# Altium schematic sheet POWER.SchDoc
size A4
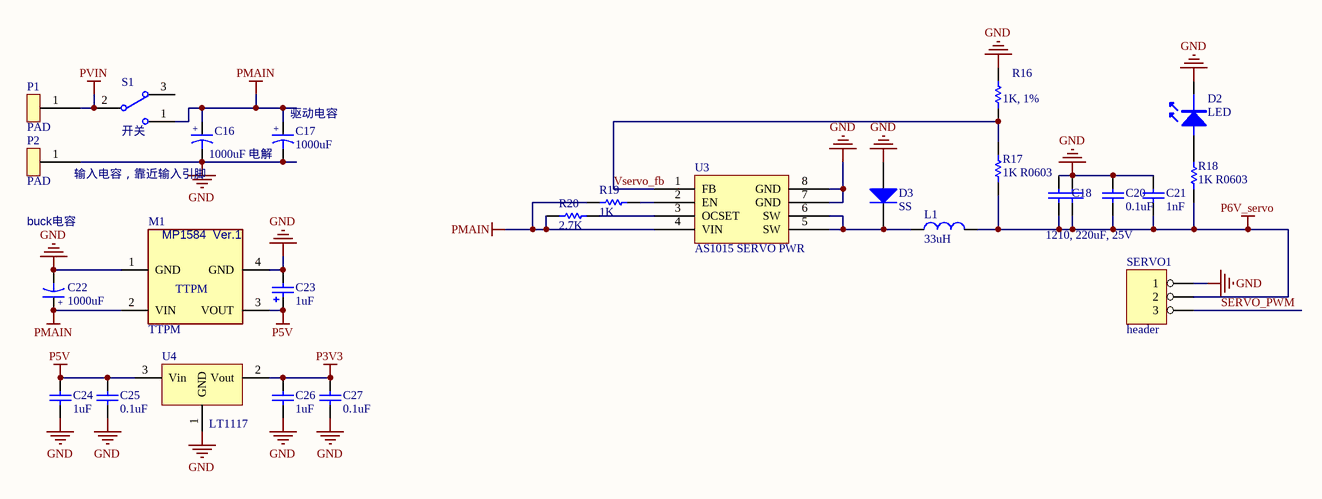
[diagram p0: POWER.SchDoc]

## Parts
C16  1000uF 电解  [CAP_1000x2000]
C17  1000uF  [CAP_1000x2000]
C18  1210, 220uF, 25V  [CAP_1000x2000]
C19  1210, 220uF, 25V  [C1210]  (value not drawn)
C20  0.1uF  [0603_C]
C21  1nF  [C1206]
C22  1000uF  [CAP_1000x2000]
C23  1uF  [CAPC6032C]
C24  1uF  [0805_c]
C25  0.1uF  [0603_C]
C26  1uF  [0805_c]
C27  0.1uF  [0603_C]
D2  LED  [0603_LED]
D3  SS  [DO-214AC(]
L1  33uH  [L 5x5]
M1  TTPM  [TTPM_1]
P1  PAD  [PAD_BIG]
P2  PAD  [PAD_BIG]
R16  1K, 1%  [0603_R]
R17  1K R0603  [0603_R]
R18  1K R0603  [0603_R]
R19  1K  [0603_R]
R20  2.7K  [0603_R]
S1  开关  [拨动开关]
SERVO1  header  [header3]
U3  AS1015 SERVO PWR  [SOIC-8]
U4  LT1117  [SOT-223]

## Nets
GND: C16.2 C17.2 C18.2 C19.2 C20.2 C21.2 C22.2 C23.2 C24.1 C25.1 C26.1 C27.1 D2.2(K) D3.1(A) M1.1(GND) M1.4(GND) P2.1 R16.2 SERVO1.1 U3.7(GND) U3.8(GND) U4.1(GND)
P3V3: C26.2 C27.2 U4.2(Vout)
P5V: C23.1 C24.2 C25.2 M1.3(VOUT) U4.3(Vin)
P6V_servo: C18.1 C19.1 C20.1 C21.1 L1.2 R17.1 R18.1 SERVO1.2
PMAIN: C16.1 C17.1 C22.1 M1.2(VIN) R19.1 R20.1 S1.1 U3.4(VIN)
PVIN: P1.1 S1.2
SERVO_PWM: SERVO1.3
Vservo_fb: R16.1 R17.2 U3.1(FB)
NetD2_1: D2.1(A) R18.2
NetD3_2: D3.2(K) L1.1 U3.5(SW) U3.6(SW)
NetR19_2: R19.2 U3.2(EN)
NetR20_2: R20.2 U3.3(OCSET)

Not connected (* = marked no-connect by the designer): S1 3

## Notes on the sheet
- (near C17) 驱动电容
- buck电容
- 输入电容，靠近输入引脚
- (in symbol CAP1) +
- (in symbol TT_PWR_MOD) MP1584  Ver.1

## Library data of the parts
C16 C17 C22 = CAP1
C18-C21 C24-C27 = CAP: Capacitor; Value: 104; Published: 8-Jun-2000; LatestRevisionDate: 17-Jul-2002; LatestRevisionNote: Re-released for DXP Platform.; PackageReference: RAD-0.3; Publisher: Altium Limited
C23 = CAP_tan: Capacitor; Value: 104; Published: 8-Jun-2000; LatestRevisionDate: 17-Jul-2002; LatestRevisionNote: Re-released for DXP Platform.; PackageReference: RAD-0.3; Publisher: Altium Limited
D2 = LED: LED 发光二极管
D3 = SS24
L1 = Inductor
M1 = TT_PWR_MOD
R16 R19 = RES0: Resistor; Published: 8-Jun-2000; Revision: July-2002: Re-released for DXP Platform.; Publisher: Altium Limited; Value: 1K
R17 R18 = RES: Resistor; Published: 8-Jun-2000; Revision: July-2002: Re-released for DXP Platform.; Publisher: Altium Limited; Value: 1K
R20 = RES0: Resistor; Value: 1K; Published: 8-Jun-2000; Revision: July-2002: Re-released for DXP Platform.; Publisher: Altium Limited
S1 = switch 3
SERVO1 = HEADER 3
U3 = AS1015
U4 = AMS1117: 3.3V电压转换器AMS1117